# Altium schematic sheet Transistor.SchDoc: =ProjectTitle
size 420 x 297 mm; Address1: Address1; Address2: Address2; Address3: Address3; Address4: Address4; SheetNumber: 2; SheetTotal: 4; Scale: 1:1; DocumentType: Схема электрическая принципиальная
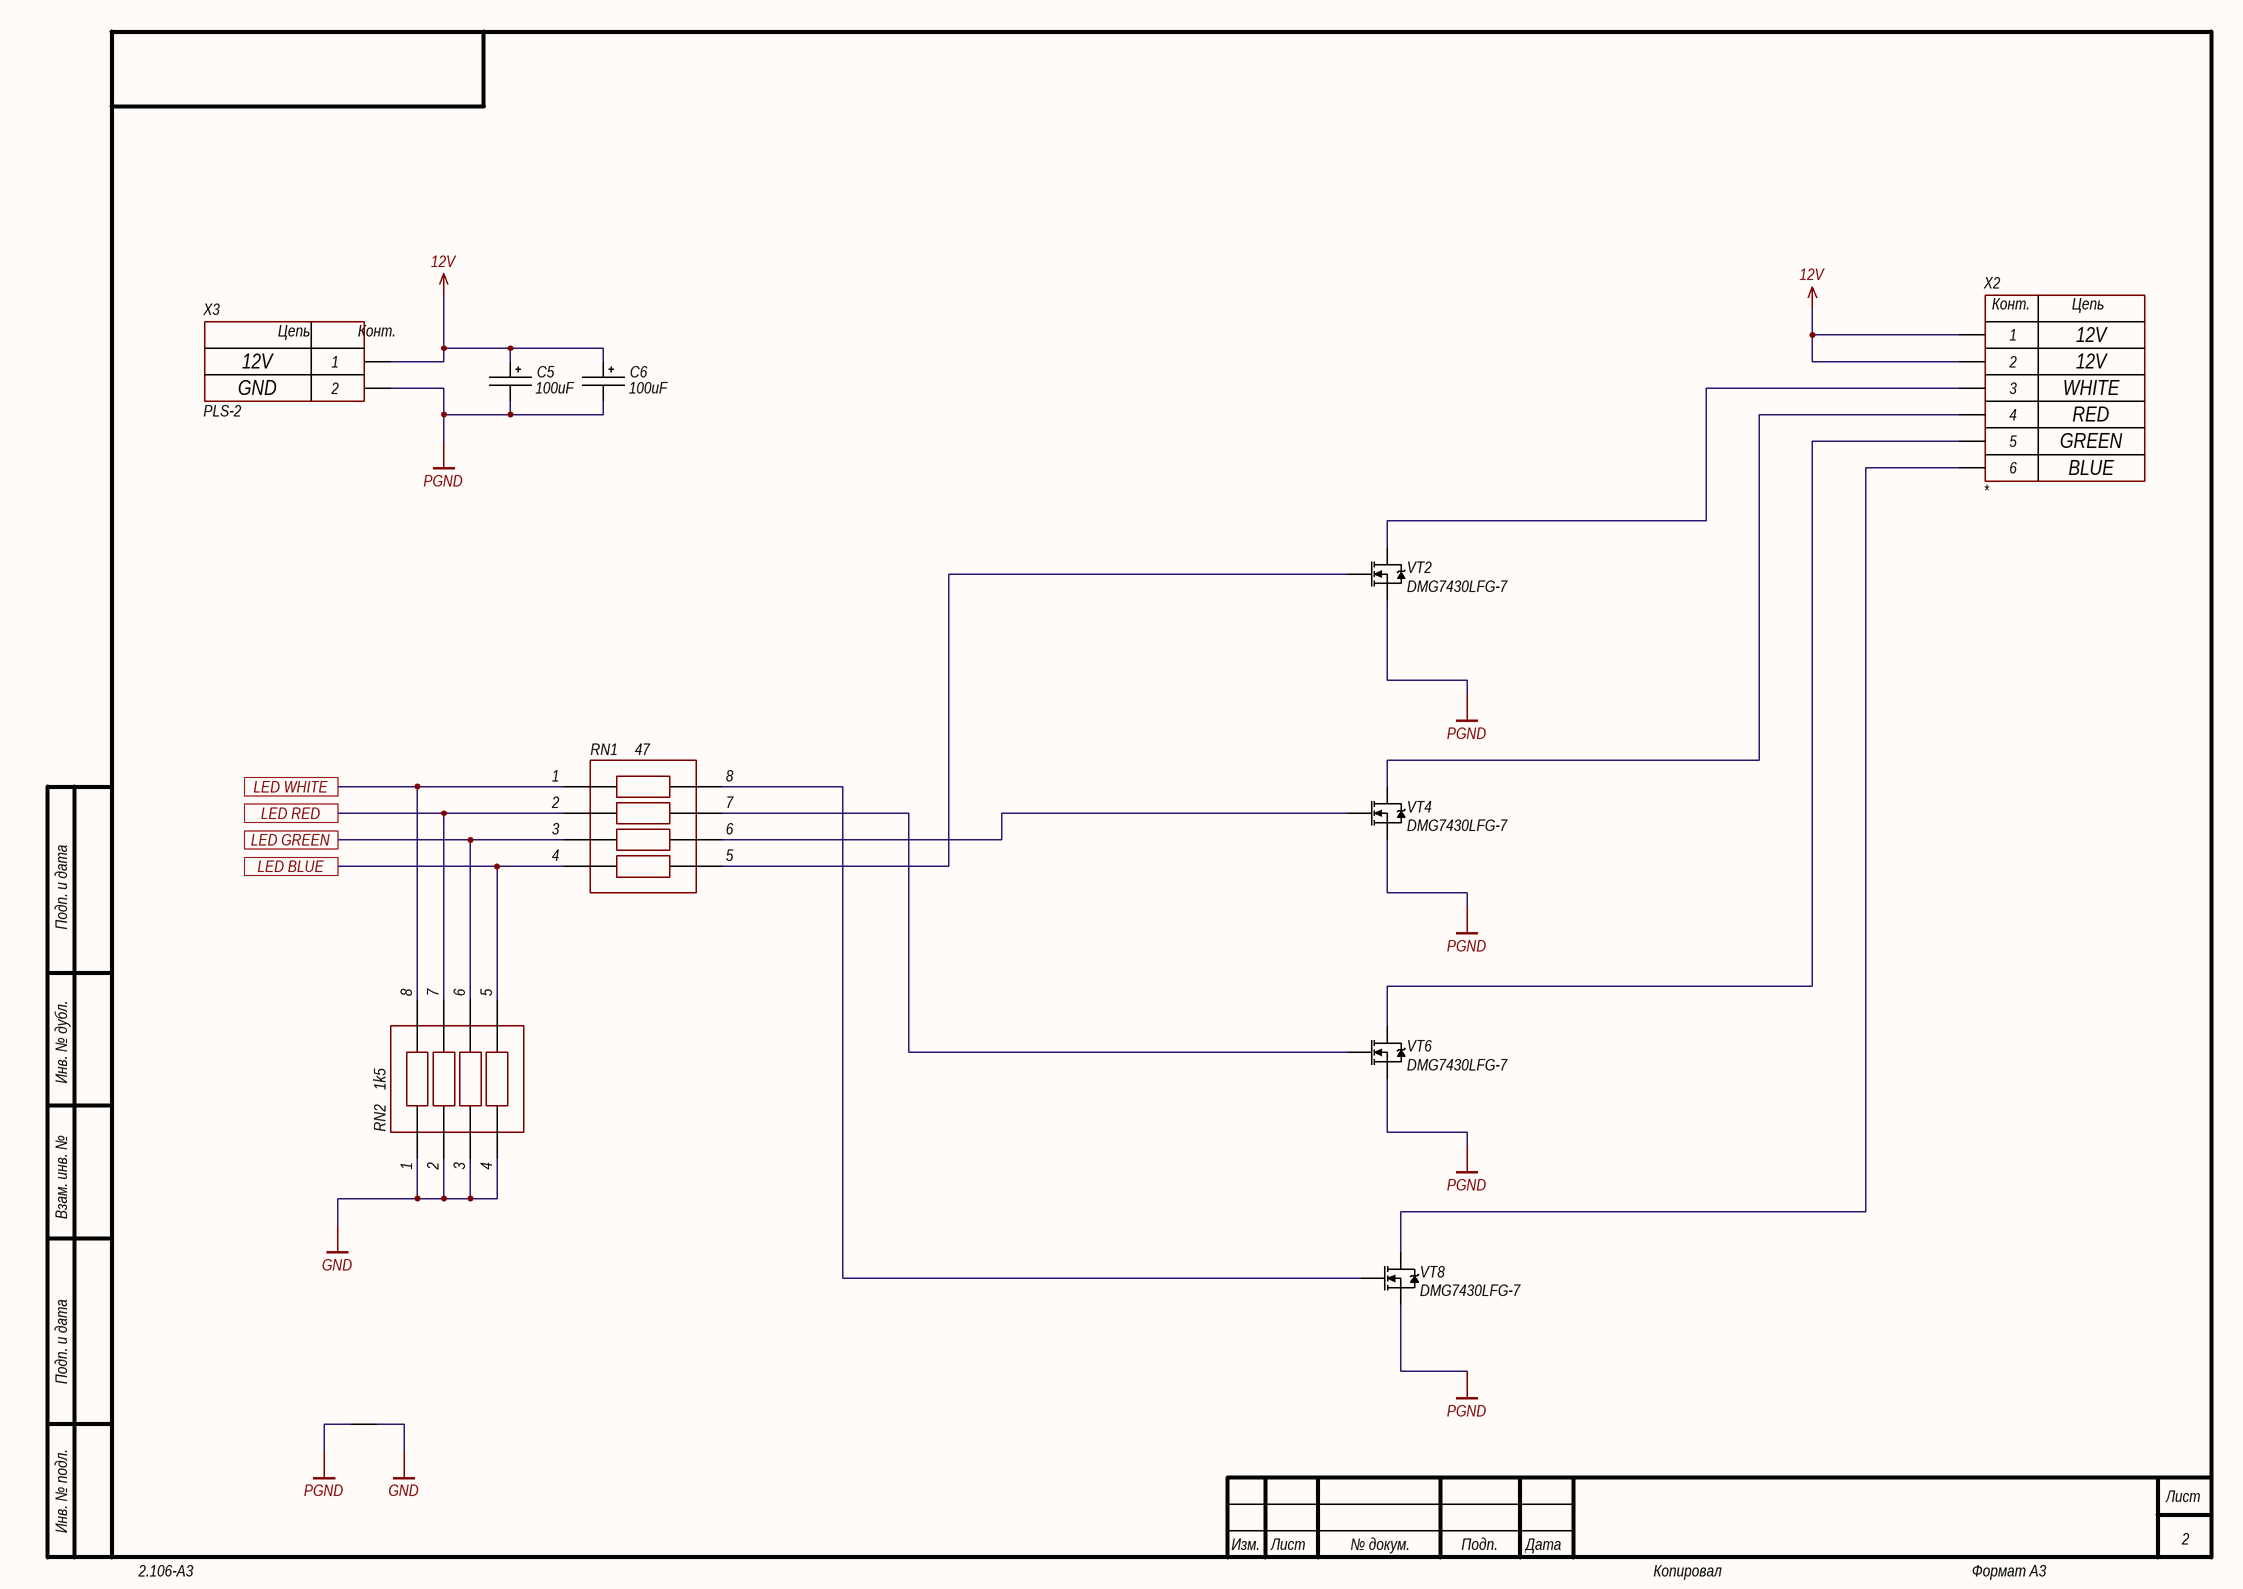
[diagram p0: Transistor.SchDoc]

## Parts
C5  100uF  [D5C2H11]
C6  100uF  [D5C2H11]
RN1  47  [CH0603Rx4 (1206)]
RN2  1k5  [CH0603Rx4 (1206)]
VT2  DMG7430LFG-7  [TRANS: PowerDI®3333-8]
VT4  DMG7430LFG-7  [TRANS: PowerDI®3333-8]
VT6  DMG7430LFG-7  [TRANS: PowerDI®3333-8]
VT8  DMG7430LFG-7  [TRANS: PowerDI®3333-8]
W1  Net Tie  [CON: Net Tie]  (value not drawn)  (net tie, no BOM)
X2  *  [CON: PLS-6]
X3  PLS-2  [CON: PLS-2]

## Ports
LED BLUE, LED GREEN, LED RED, LED WHITE

## Nets
12V: C5.1 C6.1 X2.1 X2.2 X3.1
GND: RN2.1 RN2.2 RN2.3 RN2.4 W1.2
PGND: C5.2 C6.2 VT2.3(S) VT4.3(S) VT6.3(S) VT8.3(S) W1.1 X3.2
LED BLUE: RN1.4 RN2.5 ; port LED BLUE
LED GREEN: RN1.3 RN2.6 ; port LED GREEN
LED RED: RN1.2 RN2.7 ; port LED RED
LED WHITE: RN1.1 RN2.8 ; port LED WHITE
NetRN1_5: RN1.5 VT2.1(G)
NetRN1_6: RN1.6 VT4.1(G)
NetRN1_7: RN1.7 VT6.1(G)
NetRN1_8: RN1.8 VT8.1(G)
NetVT2_2: VT2.2(D) X2.3
NetVT4_2: VT4.2(D) X2.4
NetVT6_2: VT6.2(D) X2.5
NetVT8_2: VT8.2(D) X2.6

## Notes on the sheet
- 12V
- GND
- WHITE
- RED
- GREEN
- BLUE
- Подп. и дата
- Инв. № дубл.
- Взам. инв. №
- Инв. № подл.
- Изм.
- Лист
- № докум.
- Подп.
- Дата
- 2.106-A3
- Копировал
- Формат А3
- (in symbol 2-Connector) Цепь; Конт.
- (in symbol 6-Connector) Конт.; Цепь

## Library data of the parts
C5 C6 = AlumCap: Manufacturer: *; Model: *; HelpURL: *; ComponentKind: *; Value: 100uF
RN1 RN2 = Resistor assembly: Manufacturer: Bourns GmbH.; Model: CAT16-J4; HelpURL: https://www.terraelectronica.ru/pdf/show?pdf_file=https%253A%252F%252Fwww.mouser.com%252Fds%252F2%252F54%252FATCAY-777361.pdf; ComponentKind: *
  RN1: Value: 47
  RN2: Value: 1k5
VT2 VT4 VT6 VT8 = N-chanel: Mosfet; Manufacturer: Diodes Incorporated; Model: DMG7430LFG-7; ComponentKind: 30V, 10A; HelpURL: https://www.diodes.com/assets/Datasheets/DMG7430LFG.pdf
X2 = 6-Connector: Model: *; Manufacturer: *; HelpURL: *; ComponentKind: *
X3 = 2-Connector: Model: PLS-2; Manufacturer: *; HelpURL: *; ComponentKind: *